# EAGLE design writecard_better (EAGLE 7.2.0)
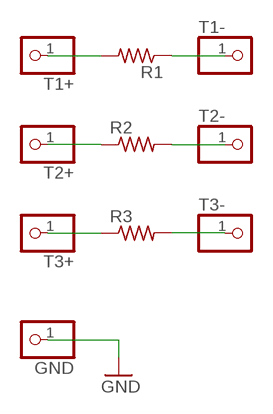
[diagram p0: schematic, sheet 1]

## Parts
GND  PINHD-1X1  [1X01]
R1  R-US_R1206  [R1206]
R2  R-US_R1206  [R1206]
R3  R-US_R1206  [R1206]
T1+  PINHD-1X1  [1X01]
T1-  PINHD-1X1  [1X01]
T2+  PINHD-1X1  [1X01]
T2-  PINHD-1X1  [1X01]
T3+  PINHD-1X1  [1X01]
T3-  PINHD-1X1  [1X01]

## Nets
GND: GND.1
N$1: R1.1 T1-.1
N$2: R1.2 T1+.1
N$3: R3.1 T3+.1
N$4: R2.1 T2+.1
N$5: R2.2 T2-.1
N$6: R3.2 T3-.1

## Library data of the parts
GND T1+ T1- T2+ T2- T3+ T3- = pinhead:PINHD-1X1: PIN HEADER
R1-R3 = resistor:R-US_: RESISTOR, American symbol

## Board
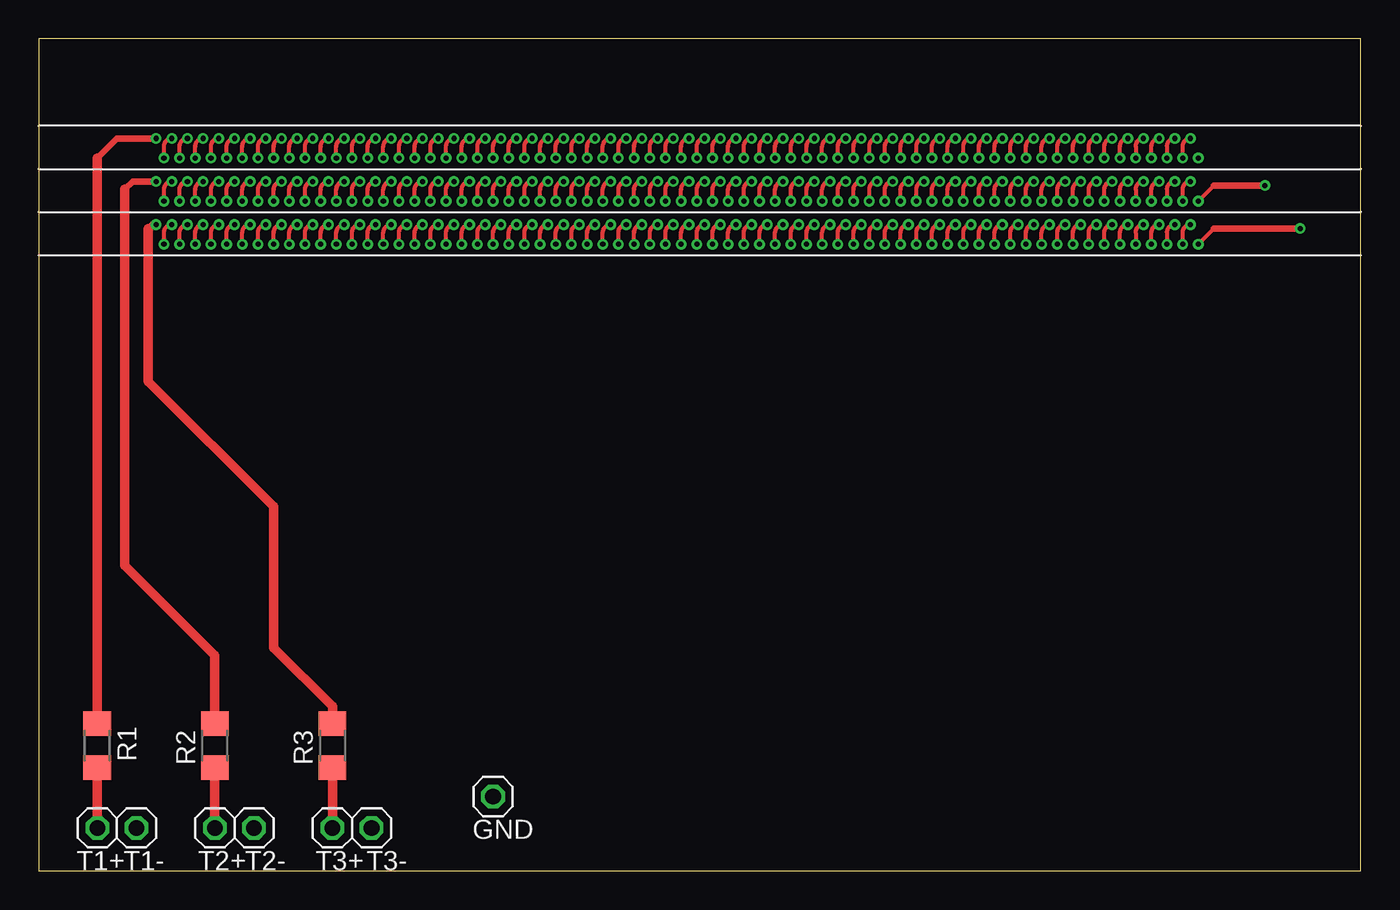
[diagram p1: board, top side]
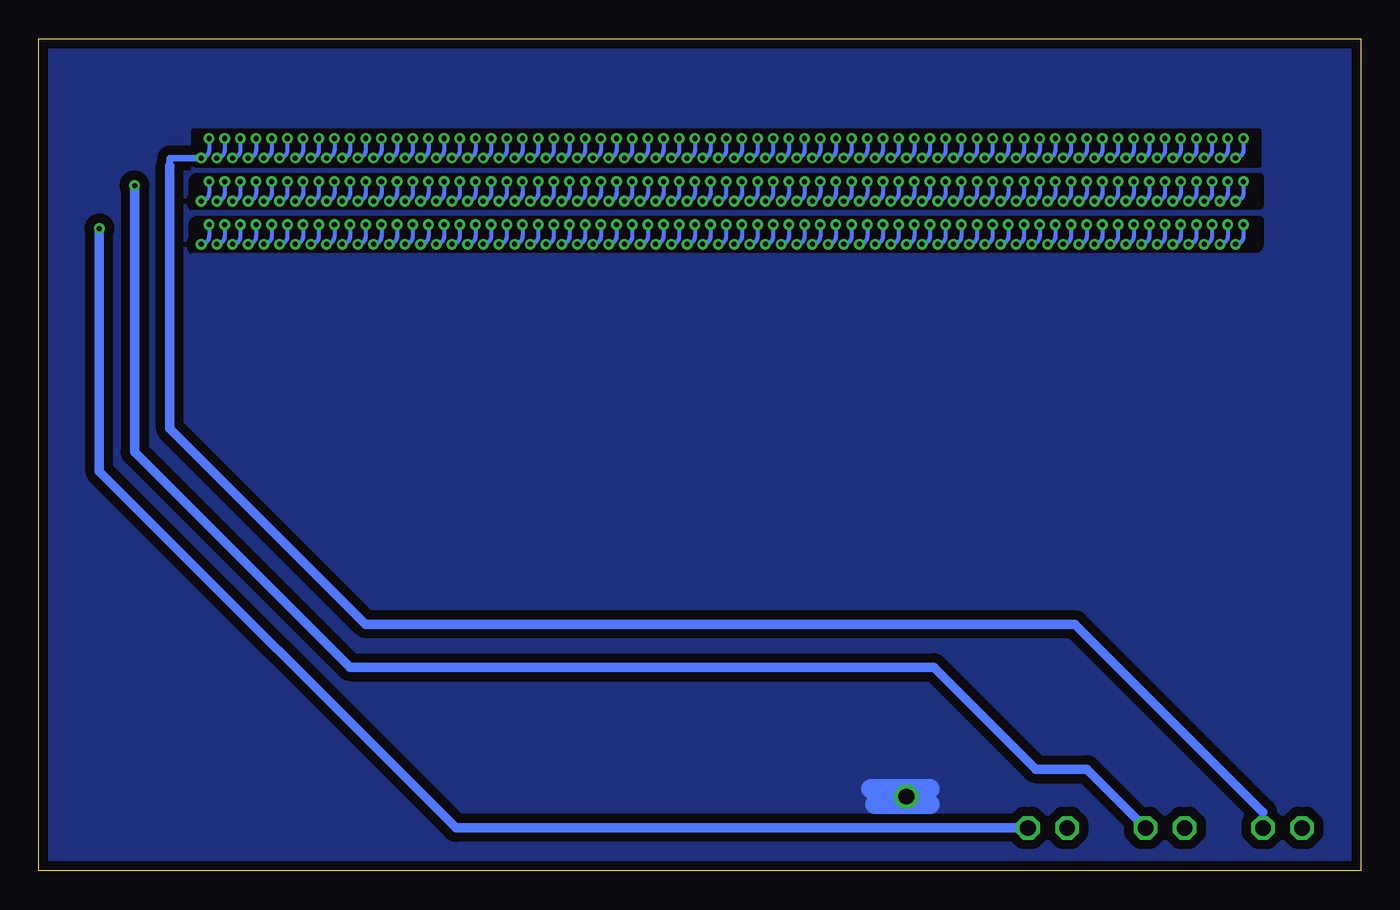
[diagram p2: board, bottom side, seen from below]

Size 85.72 x 53.98 mm. Coordinates in mm from the lower left corner, seen from the top.
Outline: 0,0 85.72,0 85.72,53.98 0,53.98 0,0
Copper layers (1*16): Top 0.0356mm / dielectric 1.5011mm / Bottom 0.0356mm
Design rules "oshparkPCBOrder": minimum track width 6mil, minimum drill 13mil, track to track 6mil, track to pad 6mil, pad to pad 6mil, via to via 6mil, smd to smd 6mil, copper to edge 15mil, drill to drill 6mil, minimum pad ring 7mil, minimum via ring 7mil, stop-mask expansion 3mil, vias tented up to drill 0mil, thermal gap 10mil

### Footprints (pad centres in the part's own frame; a part is rotated, then mirrored left to right if it is on the bottom)
1X01 = drill 1.016 octagon: 1 0,0
R1206 = smd 1.6 x 1.803: 1 -1.422,0; 2 1.422,0

### Placement (x,y rotation side)
GND  29.46,4.83 0 top
R1  3.81,8.13 270 top
R2  11.43,8.13 90 top
R3  19.05,8.13 90 top
T1+  3.81,2.79 0 top
T1-  6.35,2.79 0 top
T2+  11.43,2.79 0 top
T2-  13.97,2.79 0 top
T3+  19.05,2.79 0 top
T3-  21.59,2.79 0 top

### Tracks (layer width: path | path; a pad name or v marks a point on that pad's centre or on a via)
GND
  Bottom 1.27: 27.94,5.33 31.75,5.33 | 31.5,4.32 27.94,4.32
  pour Bottom (isolate 0.61, rank 6): 0,0 0,23.37 0,54.1 85.34,54.1 arc-90 85.6,53.85 85.6,31.75 arc-90 85.85,31.5 85.85,0
  cutout Bottom: 6.6,43.18 6.6,44.96 75.44,44.96 arc-90 75.69,44.7 75.69,43.43 75.69,43.18
  cutout Bottom: 6.6,42.16 75.44,42.16 arc-90 75.69,41.91 75.69,40.39 6.86,40.39 arc-90 6.6,40.64
  pour Bottom (rank 2): 5.33,49.28 5.33,38.86 5.59,38.61 75.69,38.61 75.69,49.02 75.44,49.28
  cutout Bottom: 6.6,48.01 6.6,45.72 75.44,45.72 arc90 75.69,46.23 75.69,48.01
N$1  (via drill 0.33 pad 0.18)
  Top 0.254: v8.13,46.23 8.13,46.99 arc-90 v8.64,47.5 | v9.14,46.23 9.14,46.99 arc-90 v9.65,47.5 | v11.18,46.23 11.18,46.99 arc-90 v11.68,47.5 | v12.19,46.23 12.19,46.99 arc-90 v12.7,47.5 | v10.16,46.23 10.16,46.99 arc-90 v10.67,47.5 | v14.22,46.23 14.22,46.99 arc-90 v14.73,47.5 | v15.24,46.23 15.24,46.99 arc-90 v15.75,47.5 | v17.27,46.23 17.27,46.99 arc-90 v17.78,47.5 | v18.29,46.23 18.29,46.99 arc-90 v18.8,47.5 | v13.21,46.23 13.21,46.99 arc-90 v13.72,47.5 | v16.26,46.23 16.26,46.99 arc-90 v16.76,47.5 | v20.32,46.23 20.32,46.99 arc-90 v20.83,47.5 | v21.34,46.23 21.34,46.99 arc-90 v21.84,47.5 | v23.37,46.23 23.37,46.99 arc-90 v23.88,47.5 | v24.38,46.23 24.38,46.99 arc-90 v24.89,47.5 | v22.35,46.23 22.35,46.99 arc-90 v22.86,47.5 | v26.42,46.23 26.42,46.99 arc-90 v26.92,47.5 | v27.43,46.23 27.43,46.99 arc-90 v27.94,47.5 | v29.46,46.23 29.46,46.99 arc-90 v29.97,47.5 | v30.48,46.23 30.48,46.99 arc-90 v30.99,47.5 | v25.4,46.23 25.4,46.99 arc-90 v25.91,47.5 | v28.45,46.23 28.45,46.99 arc-90 v28.96,47.5 | v19.3,46.23 19.3,46.99 arc-90 v19.81,47.5 | v32.51,46.23 32.51,46.99 arc-90 v33.02,47.5 | v33.53,46.23 33.53,46.99 arc-90 v34.04,47.5 | v35.56,46.23 35.56,46.99 arc-90 v36.07,47.5 | v36.58,46.23 36.58,46.99 arc-90 v37.08,47.5 | v34.54,46.23 34.54,46.99 arc-90 v35.05,47.5 | v38.61,46.23 38.61,46.99 arc-90 v39.12,47.5 | v39.62,46.23 39.62,46.99 arc-90 v40.13,47.5 | v41.66,46.23 41.66,46.99 arc-90 v42.16,47.5 | v42.67,46.23 42.67,46.99 arc-90 v43.18,47.5 | v37.59,46.23 37.59,46.99 arc-90 v38.1,47.5 | v40.64,46.23 40.64,46.99 arc-90 v41.15,47.5 | v44.7,46.23 44.7,46.99 arc-90 v45.21,47.5 | v45.72,46.23 45.72,46.99 arc-90 v46.23,47.5
  Top 0.254: v47.75,46.23 47.75,46.99 arc-90 v48.26,47.5 | v48.77,46.23 48.77,46.99 arc-90 v49.28,47.5 | v46.74,46.23 46.74,46.99 arc-90 v47.24,47.5 | v50.8,46.23 50.8,46.99 arc-90 v51.31,47.5 | v51.82,46.23 51.82,46.99 arc-90 v52.32,47.5 | v53.85,46.23 53.85,46.99 arc-90 v54.36,47.5 | v54.86,46.23 54.86,46.99 arc-90 v55.37,47.5 | v49.78,46.23 49.78,46.99 arc-90 v50.29,47.5 | v52.83,46.23 52.83,46.99 arc-90 v53.34,47.5 | v43.69,46.23 43.69,46.99 arc-90 v44.2,47.5 | v31.5,46.23 31.5,46.99 arc-90 v32,47.5 | v70.61,47.5 arc90 70.1,46.99 v70.1,46.23 | v69.6,47.5 arc90 69.09,46.99 v69.09,46.23 | v68.58,47.5 arc90 68.07,46.99 v68.07,46.23 | v67.56,47.5 arc90 67.06,46.99 v67.06,46.23 | v66.55,47.5 arc90 66.04,46.99 v66.04,46.23 | v65.53,47.5 arc90 65.02,46.99 v65.02,46.23 | v64.52,47.5 arc90 64.01,46.99 v64.01,46.23 | v63.5,47.5 arc90 62.99,46.99 v62.99,46.23 | v62.48,47.5 arc90 61.98,46.99 v61.98,46.23 | v61.47,47.5 arc90 60.96,46.99 v60.96,46.23 | v60.45,47.5 arc90 59.94,46.99 v59.94,46.23 | v59.44,47.5 arc90 58.93,46.99 v58.93,46.23 | v58.42,47.5 arc90 57.91,46.99 v57.91,46.23 | v57.4,47.5 arc90 56.9,46.99 v56.9,46.23 | v55.88,46.23 55.88,46.99 arc-90 v56.39,47.5 | v72.64,47.5 arc90 72.14,46.99 v72.14,46.23 | v71.63,47.5 arc90 71.12,46.99 v71.12,46.23 | v74.68,47.5 arc90 74.17,46.99 v74.17,46.23 | v73.66,47.5 arc90 73.15,46.99 v73.15,46.23
  Top 0.406: 3.81,46.23 5.08,47.5 v7.62,47.5
  Top 0.61: R1.1 3.81,46.23
  Bottom 0.254: T1-.1 6.35,3.81 | v7.62,47.5 7.62,46.74 arc90 v8.13,46.23 | v8.64,47.5 8.64,46.74 arc90 v9.14,46.23 | v9.65,47.5 9.65,46.74 arc90 v10.16,46.23 | v10.67,47.5 10.67,46.74 arc90 v11.18,46.23 | v11.68,47.5 11.68,46.74 arc90 v12.19,46.23 | v12.7,47.5 12.7,46.74 arc90 v13.21,46.23 | v13.72,47.5 13.72,46.74 arc90 v14.22,46.23 | v14.73,47.5 14.73,46.74 arc90 v15.24,46.23 | v15.75,47.5 15.75,46.74 arc90 v16.26,46.23 | v16.76,47.5 16.76,46.74 arc90 v17.27,46.23 | v17.78,47.5 17.78,46.74 arc90 v18.29,46.23 | v18.8,47.5 18.8,46.74 arc90 v19.3,46.23 | v19.81,47.5 19.81,46.74 arc90 v20.32,46.23 | v20.83,47.5 20.83,46.74 arc90 v21.34,46.23 | v21.84,47.5 21.84,46.74 arc90 v22.35,46.23 | v22.86,47.5 22.86,46.74 arc90 v23.37,46.23 | v23.88,47.5 23.88,46.74 arc90 v24.38,46.23 | v24.89,47.5 24.89,46.74 arc90 v25.4,46.23 | v25.91,47.5 25.91,46.74 arc90 v26.42,46.23 | v26.92,47.5 26.92,46.74 arc90 v27.43,46.23 | v27.94,47.5 27.94,46.74 arc90 v28.45,46.23 | v28.96,47.5 28.96,46.74 arc90 v29.46,46.23 | v29.97,47.5 29.97,46.74 arc90 v30.48,46.23 | v30.99,47.5 30.99,46.74 arc90 v31.5,46.23 | v32,47.5 32,46.74 arc90 v32.51,46.23 | v33.02,47.5 33.02,46.74 arc90 v33.53,46.23 | v34.04,47.5 34.04,46.74 arc90 v34.54,46.23 | v35.05,47.5 35.05,46.74 arc90 v35.56,46.23 | v36.07,47.5 36.07,46.74 arc90 v36.58,46.23 | v37.08,47.5 37.08,46.74 arc90 v37.59,46.23 | v38.1,47.5 38.1,46.74 arc90 v38.61,46.23 | v39.12,47.5 39.12,46.74 arc90 v39.62,46.23 | v40.13,47.5 40.13,46.74 arc90 v40.64,46.23 | v41.15,47.5 41.15,46.74 arc90 v41.66,46.23 | v42.16,47.5 42.16,46.74 arc90 v42.67,46.23 | v43.18,47.5 43.18,46.74 arc90 v43.69,46.23
  Bottom 0.254: v44.2,47.5 44.2,46.74 arc90 v44.7,46.23 | v45.21,47.5 45.21,46.74 arc90 v45.72,46.23 | v46.23,47.5 46.23,46.74 arc90 v46.74,46.23 | v47.24,47.5 47.24,46.74 arc90 v47.75,46.23 | v48.26,47.5 48.26,46.74 arc90 v48.77,46.23 | v49.28,47.5 49.28,46.74 arc90 v49.78,46.23 | v50.29,47.5 50.29,46.74 arc90 v50.8,46.23 | v51.31,47.5 51.31,46.74 arc90 v51.82,46.23 | v52.32,47.5 52.32,46.74 arc90 v52.83,46.23 | v53.34,47.5 53.34,46.74 arc90 v53.85,46.23 | v54.36,47.5 54.36,46.74 arc90 v54.86,46.23 | v55.37,47.5 55.37,46.74 arc90 v55.88,46.23 | v71.12,46.23 arc-90 70.61,46.74 v70.61,47.5 | v70.1,46.23 arc-90 69.6,46.74 v69.6,47.5 | v69.09,46.23 arc-90 68.58,46.74 v68.58,47.5 | v68.07,46.23 arc-90 67.56,46.74 v67.56,47.5 | v67.06,46.23 arc-90 66.55,46.74 v66.55,47.5 | v66.04,46.23 arc-90 65.53,46.74 v65.53,47.5 | v65.02,46.23 arc-90 64.52,46.74 v64.52,47.5 | v64.01,46.23 arc-90 63.5,46.74 v63.5,47.5 | v62.99,46.23 arc-90 62.48,46.74 v62.48,47.5 | v61.98,46.23 arc-90 61.47,46.74 v61.47,47.5 | v60.96,46.23 arc-90 60.45,46.74 v60.45,47.5 | v59.94,46.23 arc-90 59.44,46.74 v59.44,47.5 | v58.93,46.23 arc-90 58.42,46.74 v58.42,47.5 | v57.91,46.23 arc-90 57.4,46.74 v57.4,47.5 | v56.9,46.23 arc-90 56.39,46.74 v56.39,47.5 | v73.15,46.23 arc-90 72.64,46.74 v72.64,47.5 | v72.14,46.23 arc-90 71.63,46.74 v71.63,47.5 | v75.18,46.23 arc-90 74.68,46.74 v74.68,47.5 | v74.17,46.23 arc-90 73.66,46.74 v73.66,47.5
  Bottom 0.406: v75.18,46.23 77.22,46.23 77.22,45.72
  Bottom 0.61: 6.35,3.81 18.54,16 64.52,16 77.22,28.7 77.22,45.72
N$2
  Top 0.61: T1+.1 R1.2
N$3
  Top 0.61: T3+.1 R3.1
N$4
  Top 0.61: T2+.1 R2.1
N$5  (via drill 0.33 pad 0.18)
  Top 0.254: v8.13,43.43 8.13,44.2 arc-90 v8.64,44.7 | v9.14,43.43 9.14,44.2 arc-90 v9.65,44.7 | v11.18,43.43 11.18,44.2 arc-90 v11.68,44.7 | v12.19,43.43 12.19,44.2 arc-90 v12.7,44.7 | v10.16,43.43 10.16,44.2 arc-90 v10.67,44.7 | v14.22,43.43 14.22,44.2 arc-90 v14.73,44.7 | v15.24,43.43 15.24,44.2 arc-90 v15.75,44.7 | v17.27,43.43 17.27,44.2 arc-90 v17.78,44.7 | v18.29,43.43 18.29,44.2 arc-90 v18.8,44.7 | v13.21,43.43 13.21,44.2 arc-90 v13.72,44.7 | v16.26,43.43 16.26,44.2 arc-90 v16.76,44.7 | v20.32,43.43 20.32,44.2 arc-90 v20.83,44.7 | v21.34,43.43 21.34,44.2 arc-90 v21.84,44.7 | v23.37,43.43 23.37,44.2 arc-90 v23.88,44.7 | v24.38,43.43 24.38,44.2 arc-90 v24.89,44.7 | v22.35,43.43 22.35,44.2 arc-90 v22.86,44.7 | v26.42,43.43 26.42,44.2 arc-90 v26.92,44.7 | v27.43,43.43 27.43,44.2 arc-90 v27.94,44.7 | v29.46,43.43 29.46,44.2 arc-90 v29.97,44.7 | v30.48,43.43 30.48,44.2 arc-90 v30.99,44.7 | v25.4,43.43 25.4,44.2 arc-90 v25.91,44.7 | v28.45,43.43 28.45,44.2 arc-90 v28.96,44.7 | v19.3,43.43 19.3,44.2 arc-90 v19.81,44.7 | v32.51,43.43 32.51,44.2 arc-90 v33.02,44.7 | v33.53,43.43 33.53,44.2 arc-90 v34.04,44.7 | v35.56,43.43 35.56,44.2 arc-90 v36.07,44.7 | v36.58,43.43 36.58,44.2 arc-90 v37.08,44.7 | v34.54,43.43 34.54,44.2 arc-90 v35.05,44.7 | v38.61,43.43 38.61,44.2 arc-90 v39.12,44.7 | v39.62,43.43 39.62,44.2 arc-90 v40.13,44.7 | v41.66,43.43 41.66,44.2 arc-90 v42.16,44.7 | v42.67,43.43 42.67,44.2 arc-90 v43.18,44.7 | v37.59,43.43 37.59,44.2 arc-90 v38.1,44.7 | v40.64,43.43 40.64,44.2 arc-90 v41.15,44.7 | v44.7,43.43 44.7,44.2 arc-90 v45.21,44.7 | v45.72,43.43 45.72,44.2 arc-90 v46.23,44.7 | v47.75,43.43 47.75,44.2 arc-90 v48.26,44.7
  Top 0.254: v48.77,43.43 48.77,44.2 arc-90 v49.28,44.7 | v46.74,43.43 46.74,44.2 arc-90 v47.24,44.7 | v50.8,43.43 50.8,44.2 arc-90 v51.31,44.7 | v51.82,43.43 51.82,44.2 arc-90 v52.32,44.7 | v53.85,43.43 53.85,44.2 arc-90 v54.36,44.7 | v54.86,43.43 54.86,44.2 arc-90 v55.37,44.7 | v49.78,43.43 49.78,44.2 arc-90 v50.29,44.7 | v52.83,43.43 52.83,44.2 arc-90 v53.34,44.7 | v43.69,43.43 43.69,44.2 arc-90 v44.2,44.7 | v31.5,43.43 31.5,44.2 arc-90 v32,44.7 | v70.61,44.7 arc90 70.1,44.2 v70.1,43.43 | v69.6,44.7 arc90 69.09,44.2 v69.09,43.43 | v68.58,44.7 arc90 68.07,44.2 v68.07,43.43 | v67.56,44.7 arc90 67.06,44.2 v67.06,43.43 | v66.55,44.7 arc90 66.04,44.2 v66.04,43.43 | v65.53,44.7 arc90 65.02,44.2 v65.02,43.43 | v64.52,44.7 arc90 64.01,44.2 v64.01,43.43 | v63.5,44.7 arc90 62.99,44.2 v62.99,43.43 | v62.48,44.7 arc90 61.98,44.2 v61.98,43.43 | v61.47,44.7 arc90 60.96,44.2 v60.96,43.43 | v60.45,44.7 arc90 59.94,44.2 v59.94,43.43 | v59.44,44.7 arc90 58.93,44.2 v58.93,43.43 | v58.42,44.7 arc90 57.91,44.2 v57.91,43.43 | v57.4,44.7 arc90 56.9,44.2 v56.9,43.43 | v55.88,43.43 55.88,44.2 arc-90 v56.39,44.7 | v72.64,44.7 arc90 72.14,44.2 v72.14,43.43 | v71.63,44.7 arc90 71.12,44.2 v71.12,43.43 | v74.68,44.7 arc90 74.17,44.2 v74.17,43.43 | v73.66,44.7 arc90 73.15,44.2 v73.15,43.43 | v75.18,43.43 76.2,44.45
  Top 0.406: 76.2,44.45 v79.5,44.45 | 5.59,44.2 6.1,44.7 v7.62,44.7
  Top 0.61: R2.2 11.43,13.97 5.59,19.81 5.59,44.2
  Bottom 0.254: v7.62,44.7 7.62,43.94 arc90 v8.13,43.43 | v8.64,44.7 8.64,43.94 arc90 v9.14,43.43 | v9.65,44.7 9.65,43.94 arc90 v10.16,43.43 | v10.67,44.7 10.67,43.94 arc90 v11.18,43.43 | v11.68,44.7 11.68,43.94 arc90 v12.19,43.43 | v12.7,44.7 12.7,43.94 arc90 v13.21,43.43 | v13.72,44.7 13.72,43.94 arc90 v14.22,43.43 | v14.73,44.7 14.73,43.94 arc90 v15.24,43.43 | v15.75,44.7 15.75,43.94 arc90 v16.26,43.43 | v16.76,44.7 16.76,43.94 arc90 v17.27,43.43 | v17.78,44.7 17.78,43.94 arc90 v18.29,43.43 | v18.8,44.7 18.8,43.94 arc90 v19.3,43.43 | v19.81,44.7 19.81,43.94 arc90 v20.32,43.43 | v20.83,44.7 20.83,43.94 arc90 v21.34,43.43 | v21.84,44.7 21.84,43.94 arc90 v22.35,43.43 | v22.86,44.7 22.86,43.94 arc90 v23.37,43.43 | v23.88,44.7 23.88,43.94 arc90 v24.38,43.43 | v24.89,44.7 24.89,43.94 arc90 v25.4,43.43 | v25.91,44.7 25.91,43.94 arc90 v26.42,43.43 | v26.92,44.7 26.92,43.94 arc90 v27.43,43.43 | v27.94,44.7 27.94,43.94 arc90 v28.45,43.43 | v28.96,44.7 28.96,43.94 arc90 v29.46,43.43 | v29.97,44.7 29.97,43.94 arc90 v30.48,43.43 | v30.99,44.7 30.99,43.94 arc90 v31.5,43.43 | v32,44.7 32,43.94 arc90 v32.51,43.43 | v33.02,44.7 33.02,43.94 arc90 v33.53,43.43 | v34.04,44.7 34.04,43.94 arc90 v34.54,43.43 | v35.05,44.7 35.05,43.94 arc90 v35.56,43.43 | v36.07,44.7 36.07,43.94 arc90 v36.58,43.43 | v37.08,44.7 37.08,43.94 arc90 v37.59,43.43 | v38.1,44.7 38.1,43.94 arc90 v38.61,43.43 | v39.12,44.7 39.12,43.94 arc90 v39.62,43.43 | v40.13,44.7 40.13,43.94 arc90 v40.64,43.43 | v41.15,44.7 41.15,43.94 arc90 v41.66,43.43 | v42.16,44.7 42.16,43.94 arc90 v42.67,43.43 | v43.18,44.7 43.18,43.94 arc90 v43.69,43.43 | v44.2,44.7 44.2,43.94 arc90 v44.7,43.43
  Bottom 0.254: v45.21,44.7 45.21,43.94 arc90 v45.72,43.43 | v46.23,44.7 46.23,43.94 arc90 v46.74,43.43 | v47.24,44.7 47.24,43.94 arc90 v47.75,43.43 | v48.26,44.7 48.26,43.94 arc90 v48.77,43.43 | v49.28,44.7 49.28,43.94 arc90 v49.78,43.43 | v50.29,44.7 50.29,43.94 arc90 v50.8,43.43 | v51.31,44.7 51.31,43.94 arc90 v51.82,43.43 | v52.32,44.7 52.32,43.94 arc90 v52.83,43.43 | v53.34,44.7 53.34,43.94 arc90 v53.85,43.43 | v54.36,44.7 54.36,43.94 arc90 v54.86,43.43 | v55.37,44.7 55.37,43.94 arc90 v55.88,43.43 | v71.12,43.43 arc-90 70.61,43.94 v70.61,44.7 | v70.1,43.43 arc-90 69.6,43.94 v69.6,44.7 | v69.09,43.43 arc-90 68.58,43.94 v68.58,44.7 | v68.07,43.43 arc-90 67.56,43.94 v67.56,44.7 | v67.06,43.43 arc-90 66.55,43.94 v66.55,44.7 | v66.04,43.43 arc-90 65.53,43.94 v65.53,44.7 | v65.02,43.43 arc-90 64.52,43.94 v64.52,44.7 | v64.01,43.43 arc-90 63.5,43.94 v63.5,44.7 | v62.99,43.43 arc-90 62.48,43.94 v62.48,44.7 | v61.98,43.43 arc-90 61.47,43.94 v61.47,44.7 | v60.96,43.43 arc-90 60.45,43.94 v60.45,44.7 | v59.94,43.43 arc-90 59.44,43.94 v59.44,44.7 | v58.93,43.43 arc-90 58.42,43.94 v58.42,44.7 | v57.91,43.43 arc-90 57.4,43.94 v57.4,44.7 | v56.9,43.43 arc-90 56.39,43.94 v56.39,44.7 | v73.15,43.43 arc-90 72.64,43.94 v72.64,44.7 | v72.14,43.43 arc-90 71.63,43.94 v71.63,44.7 | v75.18,43.43 arc-90 74.68,43.94 v74.68,44.7 | v74.17,43.43 arc-90 73.66,43.94 v73.66,44.7
  Bottom 0.61: T2-.1 17.78,6.6 21.08,6.6 27.69,13.21 65.53,13.21 79.5,27.18 v79.5,44.45
N$6  (via drill 0.33 pad 0.18)
  Top 0.254: v8.13,40.64 8.13,41.4 arc-90 v8.64,41.91 | v9.14,40.64 9.14,41.4 arc-90 v9.65,41.91 | v11.18,40.64 11.18,41.4 arc-90 v11.68,41.91 | v12.19,40.64 12.19,41.4 arc-90 v12.7,41.91 | v10.16,40.64 10.16,41.4 arc-90 v10.67,41.91 | v14.22,40.64 14.22,41.4 arc-90 v14.73,41.91 | v15.24,40.64 15.24,41.4 arc-90 v15.75,41.91 | v17.27,40.64 17.27,41.4 arc-90 v17.78,41.91 | v18.29,40.64 18.29,41.4 arc-90 v18.8,41.91 | v13.21,40.64 13.21,41.4 arc-90 v13.72,41.91 | v16.26,40.64 16.26,41.4 arc-90 v16.76,41.91 | v20.32,40.64 20.32,41.4 arc-90 v20.83,41.91 | v21.34,40.64 21.34,41.4 arc-90 v21.84,41.91 | v23.37,40.64 23.37,41.4 arc-90 v23.88,41.91 | v24.38,40.64 24.38,41.4 arc-90 v24.89,41.91 | v22.35,40.64 22.35,41.4 arc-90 v22.86,41.91 | v26.42,40.64 26.42,41.4 arc-90 v26.92,41.91 | v27.43,40.64 27.43,41.4 arc-90 v27.94,41.91 | v29.46,40.64 29.46,41.4 arc-90 v29.97,41.91 | v30.48,40.64 30.48,41.4 arc-90 v30.99,41.91 | v25.4,40.64 25.4,41.4 arc-90 v25.91,41.91 | v28.45,40.64 28.45,41.4 arc-90 v28.96,41.91 | v19.3,40.64 19.3,41.4 arc-90 v19.81,41.91 | v32.51,40.64 32.51,41.4 arc-90 v33.02,41.91 | v33.53,40.64 33.53,41.4 arc-90 v34.04,41.91 | v35.56,40.64 35.56,41.4 arc-90 v36.07,41.91 | v36.58,40.64 36.58,41.4 arc-90 v37.08,41.91 | v34.54,40.64 34.54,41.4 arc-90 v35.05,41.91 | v38.61,40.64 38.61,41.4 arc-90 v39.12,41.91 | v39.62,40.64 39.62,41.4 arc-90 v40.13,41.91 | v41.66,40.64 41.66,41.4 arc-90 v42.16,41.91 | v42.67,40.64 42.67,41.4 arc-90 v43.18,41.91 | v37.59,40.64 37.59,41.4 arc-90 v38.1,41.91 | v40.64,40.64 40.64,41.4 arc-90 v41.15,41.91 | v44.7,40.64 44.7,41.4 arc-90 v45.21,41.91 | v45.72,40.64 45.72,41.4 arc-90 v46.23,41.91
  Top 0.254: v47.75,40.64 47.75,41.4 arc-90 v48.26,41.91 | v48.77,40.64 48.77,41.4 arc-90 v49.28,41.91 | v46.74,40.64 46.74,41.4 arc-90 v47.24,41.91 | v50.8,40.64 50.8,41.4 arc-90 v51.31,41.91 | v51.82,40.64 51.82,41.4 arc-90 v52.32,41.91 | v53.85,40.64 53.85,41.4 arc-90 v54.36,41.91 | v54.86,40.64 54.86,41.4 arc-90 v55.37,41.91 | v49.78,40.64 49.78,41.4 arc-90 v50.29,41.91 | v52.83,40.64 52.83,41.4 arc-90 v53.34,41.91 | v43.69,40.64 43.69,41.4 arc-90 v44.2,41.91 | v31.5,40.64 31.5,41.4 arc-90 v32,41.91 | v70.61,41.91 arc90 70.1,41.4 v70.1,40.64 | v69.6,41.91 arc90 69.09,41.4 v69.09,40.64 | v68.58,41.91 arc90 68.07,41.4 v68.07,40.64 | v67.56,41.91 arc90 67.06,41.4 v67.06,40.64 | v66.55,41.91 arc90 66.04,41.4 v66.04,40.64 | v65.53,41.91 arc90 65.02,41.4 v65.02,40.64 | v64.52,41.91 arc90 64.01,41.4 v64.01,40.64 | v63.5,41.91 arc90 62.99,41.4 v62.99,40.64 | v62.48,41.91 arc90 61.98,41.4 v61.98,40.64 | v61.47,41.91 arc90 60.96,41.4 v60.96,40.64 | v60.45,41.91 arc90 59.94,41.4 v59.94,40.64 | v59.44,41.91 arc90 58.93,41.4 v58.93,40.64 | v58.42,41.91 arc90 57.91,41.4 v57.91,40.64 | v57.4,41.91 arc90 56.9,41.4 v56.9,40.64 | v55.88,40.64 55.88,41.4 arc-90 v56.39,41.91 | v72.64,41.91 arc90 72.14,41.4 v72.14,40.64 | v71.63,41.91 arc90 71.12,41.4 v71.12,40.64 | v74.68,41.91 arc90 74.17,41.4 v74.17,40.64 | v73.66,41.91 arc90 73.15,41.4 v73.15,40.64 | v75.18,40.64 76.2,41.66
  Top 0.406: 76.2,41.66 v81.79,41.66 | v7.62,41.91 7.37,41.91 7.11,41.66
  Top 0.61: 7.11,41.66 7.11,31.75 15.24,23.62 15.24,14.48 19.05,10.67 R3.2
  Bottom 0.254: v7.62,41.91 7.62,41.15 arc90 v8.13,40.64 | v8.64,41.91 8.64,41.15 arc90 v9.14,40.64 | v9.65,41.91 9.65,41.15 arc90 v10.16,40.64 | v10.67,41.91 10.67,41.15 arc90 v11.18,40.64 | v11.68,41.91 11.68,41.15 arc90 v12.19,40.64 | v12.7,41.91 12.7,41.15 arc90 v13.21,40.64 | v13.72,41.91 13.72,41.15 arc90 v14.22,40.64 | v14.73,41.91 14.73,41.15 arc90 v15.24,40.64 | v15.75,41.91 15.75,41.15 arc90 v16.26,40.64 | v16.76,41.91 16.76,41.15 arc90 v17.27,40.64 | v17.78,41.91 17.78,41.15 arc90 v18.29,40.64 | v18.8,41.91 18.8,41.15 arc90 v19.3,40.64 | v19.81,41.91 19.81,41.15 arc90 v20.32,40.64 | v20.83,41.91 20.83,41.15 arc90 v21.34,40.64 | v21.84,41.91 21.84,41.15 arc90 v22.35,40.64 | v22.86,41.91 22.86,41.15 arc90 v23.37,40.64 | v23.88,41.91 23.88,41.15 arc90 v24.38,40.64 | v24.89,41.91 24.89,41.15 arc90 v25.4,40.64 | v25.91,41.91 25.91,41.15 arc90 v26.42,40.64 | v26.92,41.91 26.92,41.15 arc90 v27.43,40.64 | v27.94,41.91 27.94,41.15 arc90 v28.45,40.64 | v28.96,41.91 28.96,41.15 arc90 v29.46,40.64 | v29.97,41.91 29.97,41.15 arc90 v30.48,40.64 | v30.99,41.91 30.99,41.15 arc90 v31.5,40.64 | v32,41.91 32,41.15 arc90 v32.51,40.64 | v33.02,41.91 33.02,41.15 arc90 v33.53,40.64 | v34.04,41.91 34.04,41.15 arc90 v34.54,40.64 | v35.05,41.91 35.05,41.15 arc90 v35.56,40.64 | v36.07,41.91 36.07,41.15 arc90 v36.58,40.64 | v37.08,41.91 37.08,41.15 arc90 v37.59,40.64 | v38.1,41.91 38.1,41.15 arc90 v38.61,40.64 | v39.12,41.91 39.12,41.15 arc90 v39.62,40.64 | v40.13,41.91 40.13,41.15 arc90 v40.64,40.64 | v41.15,41.91 41.15,41.15 arc90 v41.66,40.64 | v42.16,41.91 42.16,41.15 arc90 v42.67,40.64 | v43.18,41.91 43.18,41.15 arc90 v43.69,40.64
  Bottom 0.254: v44.2,41.91 44.2,41.15 arc90 v44.7,40.64 | v45.21,41.91 45.21,41.15 arc90 v45.72,40.64 | v46.23,41.91 46.23,41.15 arc90 v46.74,40.64 | v47.24,41.91 47.24,41.15 arc90 v47.75,40.64 | v48.26,41.91 48.26,41.15 arc90 v48.77,40.64 | v49.28,41.91 49.28,41.15 arc90 v49.78,40.64 | v50.29,41.91 50.29,41.15 arc90 v50.8,40.64 | v51.31,41.91 51.31,41.15 arc90 v51.82,40.64 | v52.32,41.91 52.32,41.15 arc90 v52.83,40.64 | v53.34,41.91 53.34,41.15 arc90 v53.85,40.64 | v54.36,41.91 54.36,41.15 arc90 v54.86,40.64 | v55.37,41.91 55.37,41.15 arc90 v55.88,40.64 | v71.12,40.64 arc-90 70.61,41.15 v70.61,41.91 | v70.1,40.64 arc-90 69.6,41.15 v69.6,41.91 | v69.09,40.64 arc-90 68.58,41.15 v68.58,41.91 | v68.07,40.64 arc-90 67.56,41.15 v67.56,41.91 | v67.06,40.64 arc-90 66.55,41.15 v66.55,41.91 | v66.04,40.64 arc-90 65.53,41.15 v65.53,41.91 | v65.02,40.64 arc-90 64.52,41.15 v64.52,41.91 | v64.01,40.64 arc-90 63.5,41.15 v63.5,41.91 | v62.99,40.64 arc-90 62.48,41.15 v62.48,41.91 | v61.98,40.64 arc-90 61.47,41.15 v61.47,41.91 | v60.96,40.64 arc-90 60.45,41.15 v60.45,41.91 | v59.94,40.64 arc-90 59.44,41.15 v59.44,41.91 | v58.93,40.64 arc-90 58.42,41.15 v58.42,41.91 | v57.91,40.64 arc-90 57.4,41.15 v57.4,41.91 | v56.9,40.64 arc-90 56.39,41.15 v56.39,41.91 | v73.15,40.64 arc-90 72.64,41.15 v72.64,41.91 | v72.14,40.64 arc-90 71.63,41.15 v71.63,41.91 | v75.18,40.64 arc-90 74.68,41.15 v74.68,41.91 | v74.17,40.64 arc-90 73.66,41.15 v73.66,41.91
  Bottom 0.61: T3-.1 58.67,2.79 81.79,25.91 v81.79,41.66